# EAGLE schematic STM32_ESP8266 (EAGLE 9.6.1)
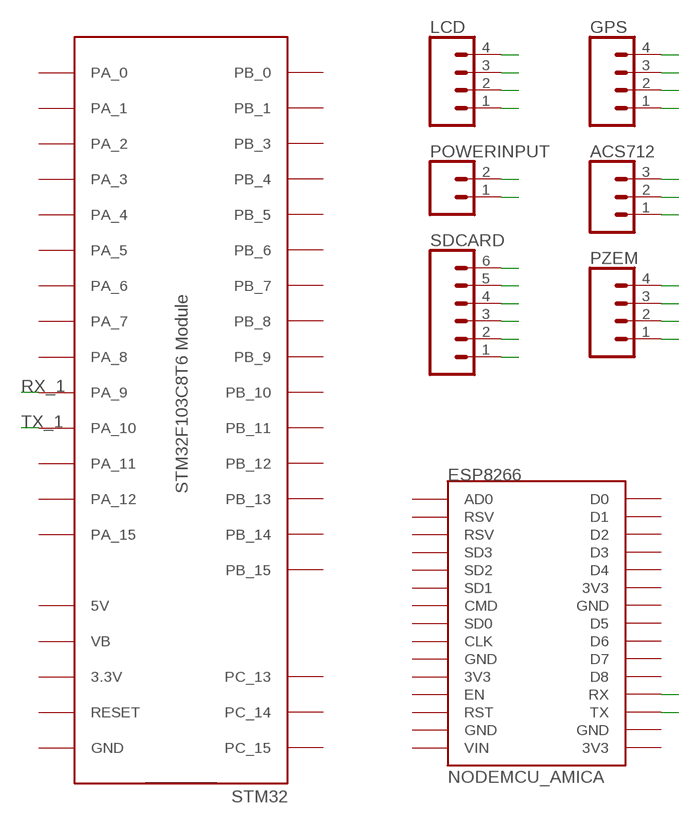
[diagram p0: schematic, sheet 1]

## Parts
ACS712  455-1750-1-ND  CONN_03  [1X03]
ESP8266  NODEMCU_AMICA  [NODEMCU_AMICA]
GPS  CONN_04PTH  [1X04]
LCD  CONN_04PTH  [1X04]
POWERINPUT  CONN_02  [1X02]
PZEM  CONN_04PTH  [1X04]
SDCARD  CONN_06SILK_FEMALE_PTH  [1X06]
STM32  STM32F103C8T6-MODULE  [STM32F103C8T6-MODULE]

## Nets
N$1: ACS712.3
N$2: ACS712.2
N$3: LCD.4
N$4: LCD.3
N$5: LCD.2
N$6: LCD.1
N$7: GPS.4
N$8: GPS.3
N$9: GPS.2
N$10: GPS.1
N$11: POWERINPUT.2
N$12: POWERINPUT.1
N$13: ACS712.1
N$14: PZEM.4
N$15: PZEM.3
N$16: PZEM.2
N$17: PZEM.1
N$18: SDCARD.6
N$19: SDCARD.5
N$20: SDCARD.4
N$21: SDCARD.3
N$22: SDCARD.2
N$23: SDCARD.1
RX_1: ESP8266.RX STM32.PA_9
TX_1: ESP8266.TX STM32.PA_10
Unconnected: ESP8266.3V3@0(3V3) ESP8266.3V3@1(3V3) ESP8266.3V3@2(3V3) ESP8266.AD0 ESP8266.CLK ESP8266.CMD ESP8266.D0 ESP8266.D1 ESP8266.D2 ESP8266.D3 ESP8266.D4 ESP8266.D5 ESP8266.D6 ESP8266.D7 ESP8266.D8 ESP8266.EN ESP8266.GND@0(GND) ESP8266.GND@1(GND) ESP8266.GND@2(GND) ESP8266.GND@3(GND) ESP8266.RST ESP8266.RSV@0(RSV) ESP8266.RSV@1(RSV) ESP8266.SD0 ESP8266.SD1 ESP8266.SD2 ESP8266.SD3 ESP8266.VIN STM32.3.3V@1(3.3V) STM32.3.3V@2(3.3V) STM32.5V STM32.GND@1(GND) STM32.GND@2(GND) STM32.GND@3(GND) STM32.PA_0 STM32.PA_1 STM32.PA_2 STM32.PA_3 STM32.PA_4 STM32.PA_5 STM32.PA_6 STM32.PA_7 STM32.PA_8 STM32.PA_11 STM32.PA_12 STM32.PA_15 STM32.PB_0 STM32.PB_1 STM32.PB_3 STM32.PB_4 STM32.PB_5 STM32.PB_6 STM32.PB_7 STM32.PB_8 STM32.PB_9 STM32.PB_10 STM32.PB_11 STM32.PB_12 STM32.PB_13 STM32.PB_14 STM32.PB_15 STM32.PC_13 STM32.PC_14 STM32.PC_15 STM32.RESET STM32.VB

## Library data of the parts
ACS712 = SparkFun-Connectors:CONN_03: Multi connection point. Often used as Generic Header-pin footprint for 0.1 inch spaced/style header connections On any of the 0.1 inch spaced packages, you can populate with these: Break Away Headers - Straight <https://www.sparkfun.com/products/116> (PRT-00116) Break Away Male Headers - Right Angle <https://www.sparkfun.com/products/553> (PRT-00553) Female Headers <https://www.sparkfun.com/products/115> (PRT-00115) Break Away Headers - Machine Pin <https://www.sparkfun.com/products/117> (PRT-00117) Break Away Female Headers - Swiss Machine Pin <https://www.sparkfun.com/products/743> (PRT-00743) Stackable Header - 3 Pin (Female, 0.1") <https://www.sparkfun.com/products/13875> (PRT-13875) For SCREWTERMINALS and SPRING TERMINALS visit here: Screw Terimnals on SparkFun.com <https://www.sparkfun.com/search/results?term=Screw+Terminals> (5mm/3.5mm/2.54mm spacing) This device is also useful as a general connection point to wire up your design to another part of your project. Our various solder wires solder well into these plated through hole pads. Hook-Up Wire - Assortment (Stranded, 22 AWG) <https://www.sparkfun.com/products/11375> (PRT-11375) Hook-Up Wire - Assortment (Solid Core, 22 AWG) <https://www.sparkfun.com/products/11367> (PRT-11367) View the entire wire category on our website here <https://www.sparkfun.com/categories/141> Special notes: Molex polarized connector foot print use with SKU : PRT-08232 with associated crimp pins and housings.; PROD_ID: XXX-00000
ESP8266 = ESP12E_DEVKIT:NODEMCU_AMICA: ESP12E DEVKIT BOARD
GPS LCD PZEM = SparkFun-Connectors:CONN_04: Multi connection point. Often used as Generic Header-pin footprint for 0.1 inch spaced/style header connections On any of the 0.1 inch spaced packages, you can populate with these: Break Away Headers - Straight <https://www.sparkfun.com/products/116> (PRT-00116) Break Away Male Headers - Right Angle <https://www.sparkfun.com/products/553> (PRT-00553) Female Headers <https://www.sparkfun.com/products/115> (PRT-00115) Break Away Headers - Machine Pin <https://www.sparkfun.com/products/117> (PRT-00117) Break Away Female Headers - Swiss Machine Pin <https://www.sparkfun.com/products/743> (PRT-00743) For SCREWTERMINALS and SPRING TERMINALS visit here: Screw Terimnals on SparkFun.com <https://www.sparkfun.com/search/results?term=Screw+Terminals> (5mm/3.5mm/2.54mm spacing) This device is also useful as a general connection point to wire up your design to another part of your project. Our various solder wires solder well into these plated through hole pads. Hook-Up Wire - Assortment (Stranded, 22 AWG) <https://www.sparkfun.com/products/11375> (PRT-11375) Hook-Up Wire - Assortment (Solid Core, 22 AWG) <https://www.sparkfun.com/products/11367> (PRT-11367) View the entire wire category on our website here <https://www.sparkfun.com/categories/141> Special notes: Molex polarized connector foot print use with SKU : PRT-08231 with associated crimp pins and housings. 1MM SMD Version SKU: PRT-10208; PROD_ID: CONN-09696
POWERINPUT = SparkFun-Connectors:CONN_02: Multi connection point. Often used as Generic Header-pin footprint for 0.1 inch spaced/style header connections On any of the 0.1 inch spaced packages, you can populate with these: Break Away Headers - Straight <https://www.sparkfun.com/products/116> (PRT-00116) Break Away Male Headers - Right Angle <https://www.sparkfun.com/products/553> (PRT-00553) Female Headers <https://www.sparkfun.com/products/115> (PRT-00115) Break Away Headers - Machine Pin <https://www.sparkfun.com/products/117> (PRT-00117) Break Away Female Headers - Swiss Machine Pin <https://www.sparkfun.com/products/743> (PRT-00743) For SCREWTERMINALS and SPRING TERMINALS visit here: Screw Terimnals on SparkFun.com <https://www.sparkfun.com/search/results?term=Screw+Terminals> (5mm/3.5mm/2.54mm spacing) This device is also useful as a general connection point to wire up your design to another part of your project. Our various solder wires solder well into these plated through hole pads. Hook-Up Wire - Assortment (Stranded, 22 AWG) <https://www.sparkfun.com/products/11375> (PRT-11375) Hook-Up Wire - Assortment (Solid Core, 22 AWG) <https://www.sparkfun.com/products/11367> (PRT-11367) View the entire wire category on our website here <https://www.sparkfun.com/categories/141> Special notes: Molex polarized connector foot print use with: PRT-08233 with associated crimp pins and housings. 2.54_SCREWTERM for use with PRT-10571. 3.5mm Screw Terminal footprints for PRT-08084 5mm Screw Terminal footprints for use with PRT-08432
SDCARD = SparkFun-Connectors:CONN_06: Multi connection point. Often used as Generic Header-pin footprint for 0.1 inch spaced/style header connections On any of the 0.1 inch spaced packages, you can populate with these: Break Away Headers - Straight <https://www.sparkfun.com/products/116> (PRT-00116) Break Away Male Headers - Right Angle <https://www.sparkfun.com/products/553> (PRT-00553) Female Headers <https://www.sparkfun.com/products/115> (PRT-00115) Break Away Headers - Machine Pin <https://www.sparkfun.com/products/117> (PRT-00117) Break Away Female Headers - Swiss Machine Pin <https://www.sparkfun.com/products/743> (PRT-00743) Arduino Stackable Header - 6 Pin <https://www.sparkfun.com/products/9280> (PRT-09280) For SCREWTERMINALS and SPRING TERMINALS visit here: Screw Terimnals on SparkFun.com <https://www.sparkfun.com/search/results?term=Screw+Terminals> (5mm/3.5mm/2.54mm spacing) This device is also useful as a general connection point to wire up your design to another part of your project. Our various solder wires solder well into these plated through hole pads. Hook-Up Wire - Assortment (Stranded, 22 AWG) <https://www.sparkfun.com/products/11375> (PRT-11375) Hook-Up Wire - Assortment (Solid Core, 22 AWG) <https://www.sparkfun.com/products/11367> (PRT-11367) View the entire wire category on our website here <https://www.sparkfun.com/categories/141>; PROD_ID: CONN-08437
STM32 = bluepill_eagle_lib:STM32F103C8T6-MODULE: STM32F103C8T6 module with ARM Cortex-3, 20kB SRAM, 64kB Flash, 72MHz